# Altium schematic sheet [02] - Buttons.SchDoc
size A4
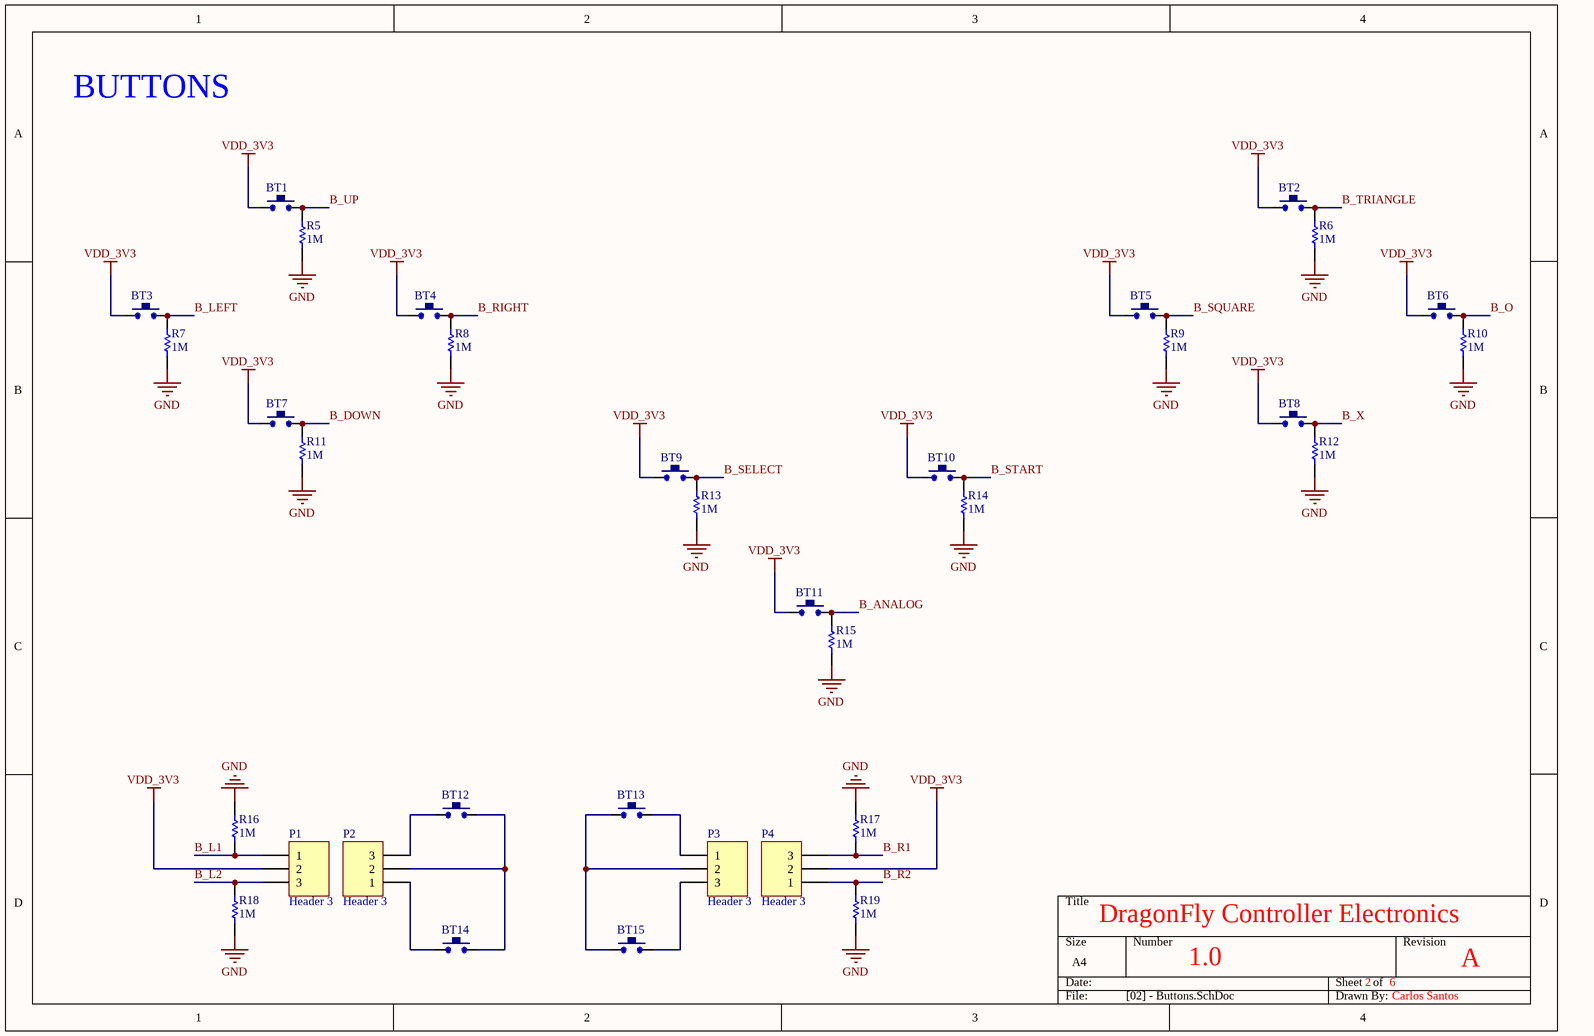
[diagram p0: [02] - Buttons.SchDoc]

## Parts
BT1  (no value)  [PCB_button_6mm_round]
BT2  (no value)  [PCB_button_6mm_round]
BT3  (no value)  [PCB_button_6mm_round]
BT4  (no value)  [PCB_button_6mm_round]
BT5  (no value)  [PCB_button_6mm_round]
BT6  (no value)  [PCB_button_6mm_round]
BT7  (no value)  [PCB_button_6mm_round]
BT8  (no value)  [PCB_button_6mm_round]
BT9  (no value)  [PCB_button_10x6mm_rect]
BT10  (no value)  [PCB_button_10x6mm_rect]
BT11  (no value)  [PCB_button_10x6mm_rect]
BT12  (no value)  [PCB_button_10x10mm_rect]
BT13  (no value)  [PCB_button_10x10mm_rect]
BT14  (no value)  [PCB_button_12x10mm_rect]
BT15  (no value)  [PCB_button_12x10mm_rect]
P1  Header 3  [HDR1X3]
P2  Header 3  [HDR1X3]
P3  Header 3  [HDR1X3]
P4  Header 3  [HDR1X3]
R5  value 1M  [0402 - Resistor]  (hidden comment: Resistor)
R6  value 1M  [0402 - Resistor]  (hidden comment: Resistor)
R7  value 1M  [0402 - Resistor]  (hidden comment: Resistor)
R8  value 1M  [0402 - Resistor]  (hidden comment: Resistor)
R9  value 1M  [0402 - Resistor]  (hidden comment: Resistor)
R10  value 1M  [0402 - Resistor]  (hidden comment: Resistor)
R11  value 1M  [0402 - Resistor]  (hidden comment: Resistor)
R12  value 1M  [0402 - Resistor]  (hidden comment: Resistor)
R13  value 1M  [0402 - Resistor]  (hidden comment: Resistor)
R14  value 1M  [0402 - Resistor]  (hidden comment: Resistor)
R15  value 1M  [0402 - Resistor]  (hidden comment: Resistor)
R16  value 1M  [0402 - Resistor]  (hidden comment: Resistor)
R17  value 1M  [0402 - Resistor]  (hidden comment: Resistor)
R18  value 1M  [0402 - Resistor]  (hidden comment: Resistor)
R19  value 1M  [0402 - Resistor]  (hidden comment: Resistor)

## Nets
GND: R5.1 R6.1 R7.1 R8.1 R9.1 R10.1 R11.1 R12.1 R13.1 R14.1 R15.1 R16.2 R17.2 R18.1 R19.1
VDD_3V3: BT1.1 BT2.1 BT3.1 BT4.1 BT5.1 BT6.1 BT7.1 BT8.1 BT9.1 BT10.1 BT11.1 P1.2 P4.2
B_ANALOG: BT11.2 R15.2
B_DOWN: BT7.2 R11.2
B_L1: P1.1 R16.1
B_L2: P1.3 R18.2
B_LEFT: BT3.2 R7.2
B_O: BT6.2 R10.2
B_R1: P4.3 R17.1
B_R2: P4.1 R19.2
B_RIGHT: BT4.2 R8.2
B_SELECT: BT9.2 R13.2
B_SQUARE: BT5.2 R9.2
B_START: BT10.2 R14.2
B_TRIANGLE: BT2.2 R6.2
B_UP: BT1.2 R5.2
B_X: BT8.2 R12.2
NetBT12_1: BT12.1 P2.3
NetBT12_2: BT12.2 BT14.2 P2.2
NetBT13_1: BT13.1 BT15.1 P3.2
NetBT13_2: BT13.2 P3.1
NetBT14_1: BT14.1 P2.1
NetBT15_2: BT15.2 P3.3

## Notes on the sheet
- BUTTONS
- DragonFly Controller Electronics
- 1.0
- 2
- 6
- A
- Carlos Santos

## Library data of the parts
BT1-BT15 = PCB button
P1-P4 = Header 3: Header, 3-Pin; LatestRevisionDate: 17-Jul-2002; LatestRevisionNote: Re-released for DXP Platform.; Publisher: Altium Limited